# EAGLE design J3_output (EAGLE 7.7.0)
Redwave S310-J6 Output to 10 Pin MiniFit Valve Driver Board
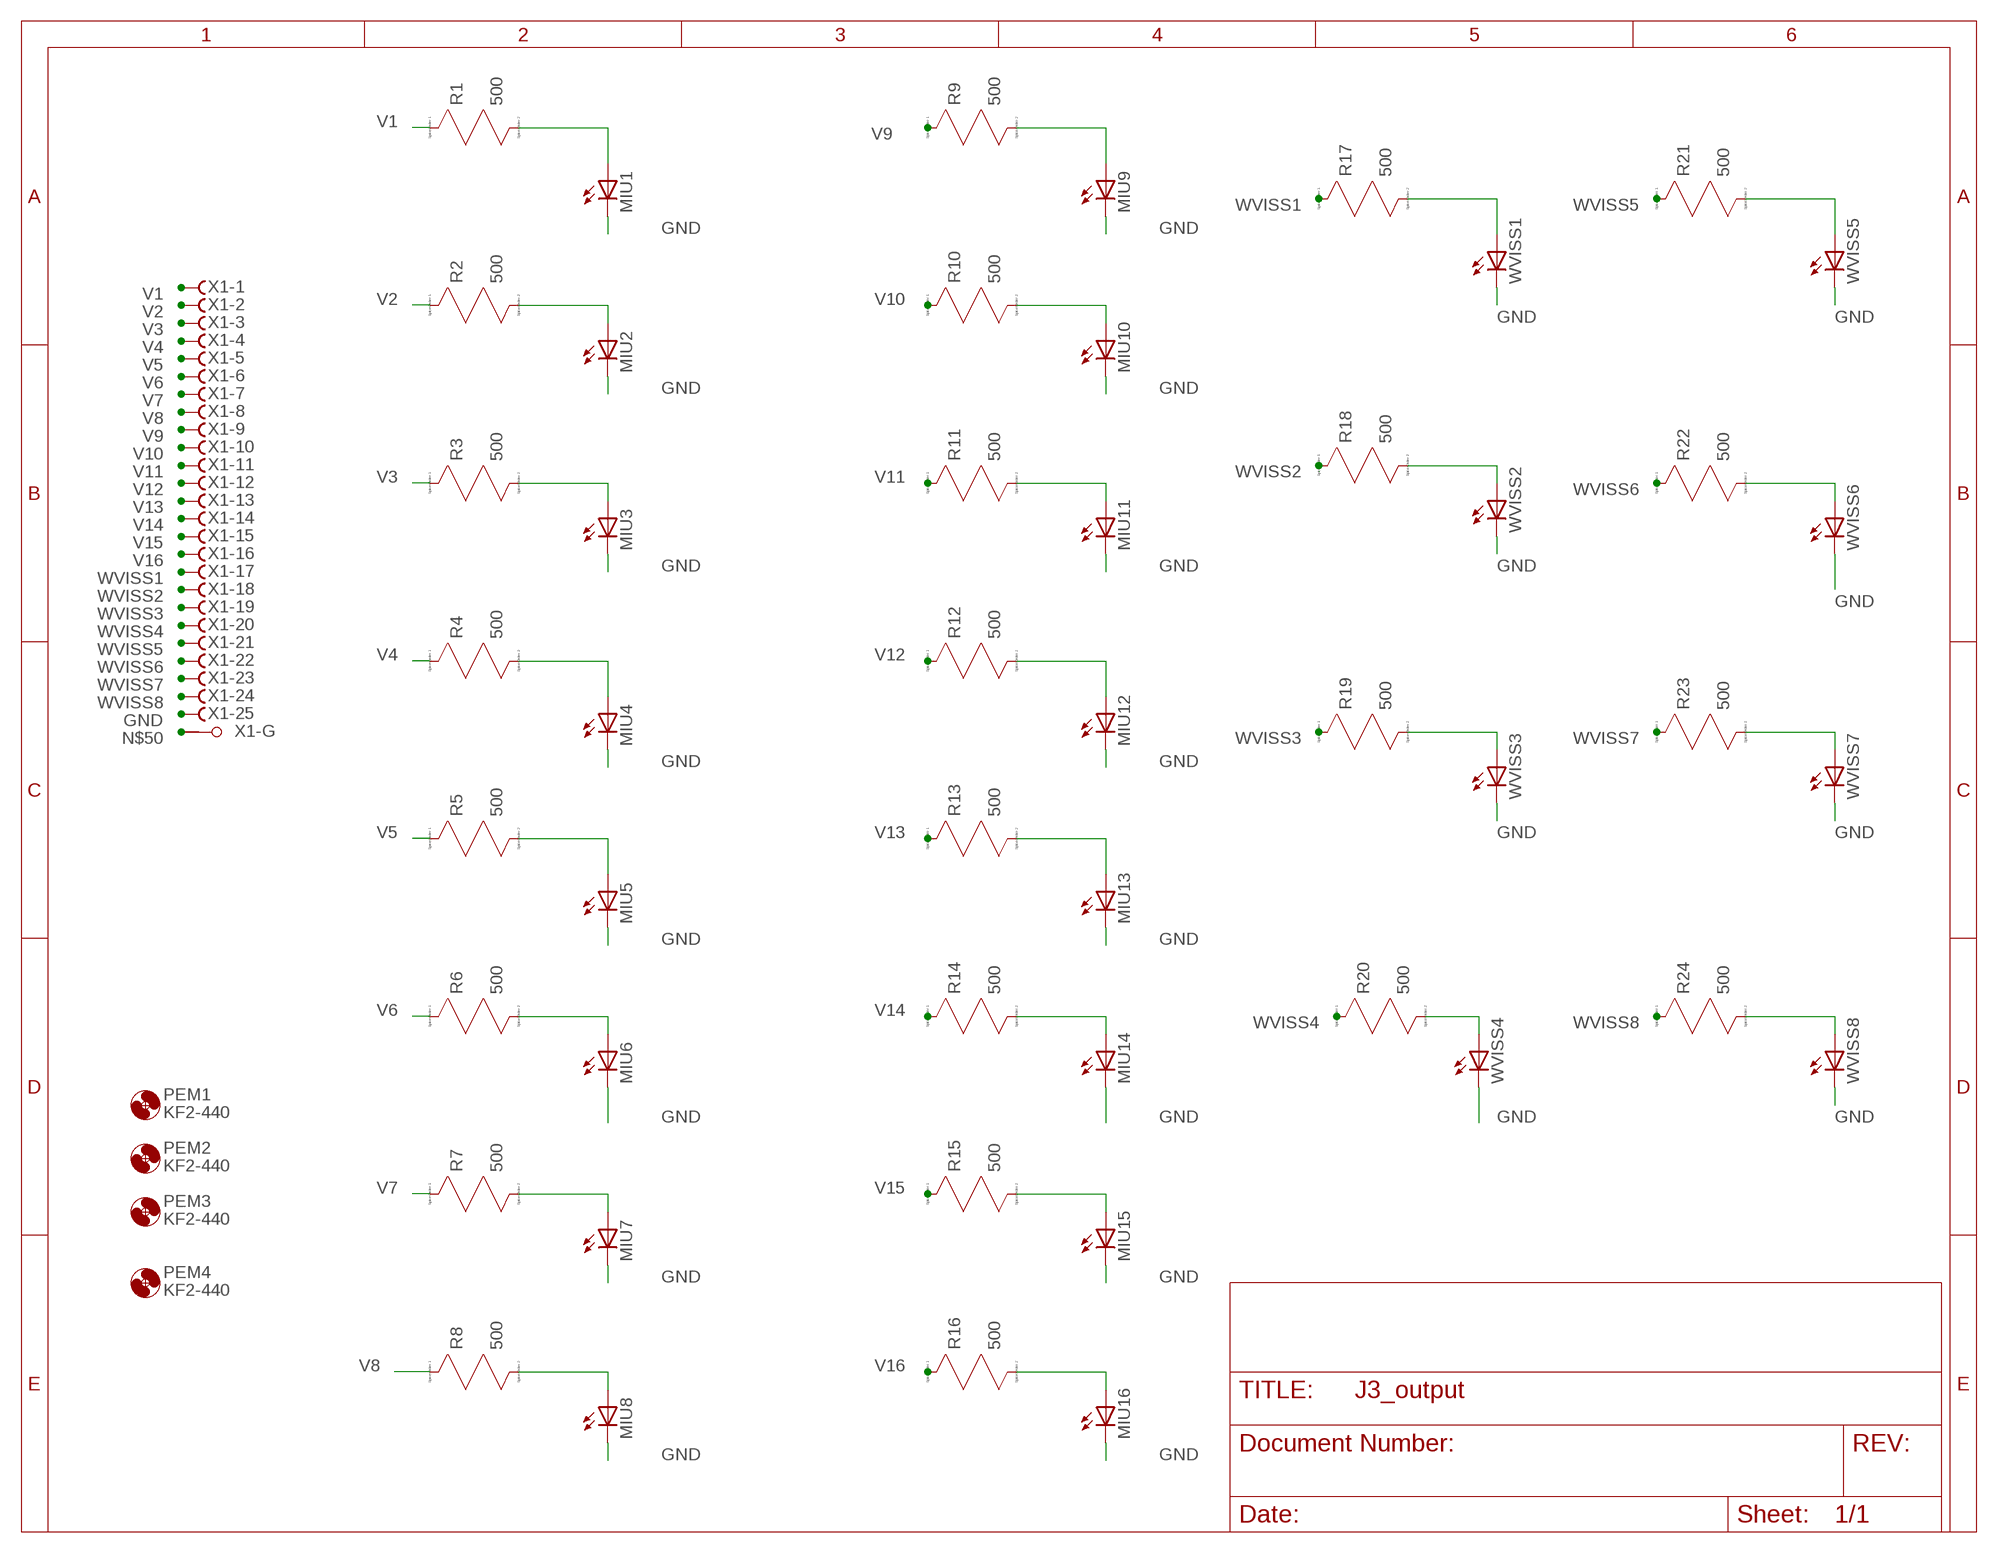
[diagram p0: schematic, sheet 1]

## Parts
MIU1  LED5MM  [LED5MM]
MIU2  LED5MM  [LED5MM]
MIU3  LED5MM  [LED5MM]
MIU4  LED5MM  [LED5MM]
MIU5  LED5MM  [LED5MM]
MIU6  LED5MM  [LED5MM]
MIU7  LED5MM  [LED5MM]
MIU8  LED5MM  [LED5MM]
MIU9  LED5MM  [LED5MM]
MIU10  LED5MM  [LED5MM]
MIU11  LED5MM  [LED5MM]
MIU12  LED5MM  [LED5MM]
MIU13  LED5MM  [LED5MM]
MIU14  LED5MM  [LED5MM]
MIU15  LED5MM  [LED5MM]
MIU16  LED5MM  [LED5MM]
PEM1  KF2-440  [KF2-440]
PEM2  KF2-440  [KF2-440]
PEM3  KF2-440  [KF2-440]
PEM4  KF2-440  [KF2-440]
R1  500  RES  [R0805]
R2  500  RES  [R0805]
R3  500  RES  [R0805]
R4  500  RES  [R0805]
R5  500  RES  [R0805]
R6  500  RES  [R0805]
R7  500  RES  [R0805]
R8  500  RES  [R0805]
R9  500  RES  [R0805]
R10  500  RES  [R0805]
R11  500  RES  [R0805]
R12  500  RES  [R0805]
R13  500  RES  [R0805]
R14  500  RES  [R0805]
R15  500  RES  [R0805]
R16  500  RES  [R0805]
R17  500  RES  [R0805]
R18  500  RES  [R0805]
R19  500  RES  [R0805]
R20  500  RES  [R0805]
R21  500  RES  [R0805]
R22  500  RES  [R0805]
R23  500  RES  [R0805]
R24  500  RES  [R0805]
WVISS1  LED5MM  [LED5MM]
WVISS2  LED5MM  [LED5MM]
WVISS3  LED5MM  [LED5MM]
WVISS4  LED5MM  [LED5MM]
WVISS5  LED5MM  [LED5MM]
WVISS6  LED5MM  [LED5MM]
WVISS7  LED5MM  [LED5MM]
WVISS8  LED5MM  [LED5MM]
X1  F25HPS  [F25HP]

## Nets
GND: MIU1.K(C) MIU2.K(C) MIU3.K(C) MIU4.K(C) MIU5.K(C) MIU6.K(C) MIU7.K(C) MIU8.K(C) MIU9.K(C) MIU10.K(C) MIU11.K(C) MIU12.K(C) MIU13.K(C) MIU14.K(C) MIU15.K(C) MIU16.K(C) WVISS1.K(C) WVISS2.K(C) WVISS3.K(C) WVISS4.K(C) WVISS5.K(C) WVISS6.K(C) WVISS7.K(C) WVISS8.K(C) X1.25(-25:F)
N$1: MIU1.A R1.2(B)
N$2: MIU2.A R2.2(B)
N$3: MIU3.A R3.2(B)
N$4: MIU4.A R4.2(B)
N$5: MIU5.A R5.2(B)
N$6: MIU6.A R6.2(B)
N$7: MIU7.A R7.2(B)
N$8: MIU8.A R8.2(B)
N$9: MIU9.A R9.2(B)
N$10: MIU10.A R10.2(B)
N$11: MIU11.A R11.2(B)
N$12: MIU12.A R12.2(B)
N$13: MIU13.A R13.2(B)
N$14: MIU14.A R14.2(B)
N$15: MIU15.A R15.2(B)
N$16: MIU16.A R16.2(B)
N$17: R17.2(B) WVISS1.A
N$18: R18.2(B) WVISS2.A
N$19: R19.2(B) WVISS3.A
N$20: R20.2(B) WVISS4.A
N$21: R21.2(B) WVISS5.A
N$22: R22.2(B) WVISS6.A
N$23: R23.2(B) WVISS7.A
N$24: R24.2(B) WVISS8.A
N$50: X1.G1(-G:G1)
V1: R1.1(A) X1.1(-1:F)
V2: R2.1(A) X1.2(-2:F)
V3: R3.1(A) X1.3(-3:F)
V4: R4.1(A) X1.4(-4:F)
V5: R5.1(A) X1.5(-5:F)
V6: R6.1(A) X1.6(-6:F)
V7: R7.1(A) X1.7(-7:F)
V8: R8.1(A) X1.8(-8:F)
V9: R9.1(A) X1.9(-9:F)
V10: R10.1(A) X1.10(-10:F)
V11: R11.1(A) X1.11(-11:F)
V12: R12.1(A) X1.12(-12:F)
V13: R13.1(A) X1.13(-13:F)
V14: R14.1(A) X1.14(-14:F)
V15: R15.1(A) X1.15(-15:F)
V16: R16.1(A) X1.16(-16:F)
WVISS1: R17.1(A) X1.17(-17:F)
WVISS2: R18.1(A) X1.18(-18:F)
WVISS3: R19.1(A) X1.19(-19:F)
WVISS4: R20.1(A) X1.20(-20:F)
WVISS5: R21.1(A) X1.21(-21:F)
WVISS6: R22.1(A) X1.22(-22:F)
WVISS7: R23.1(A) X1.23(-23:F)
WVISS8: R24.1(A) X1.24(-24:F)
Unconnected: X1.G2(-G:G2)

## Library data of the parts
MIU1-MIU16 WVISS1-WVISS8 = led:LED: LED OSRAM: - CHIPLED LG R971, LG N971, LY N971, LG Q971, LY Q971, LO R971, LY R971 LH N974, LH R974 LS Q976, LO Q976, LY Q976 LO Q996 - Hyper CHIPLED LW Q18S LB Q993, LB Q99A, LB R99A - SideLED LS A670, LO A670, LY A670, LG A670, LP A670 LB A673, LV A673, LT A673, LW A673 LH A674 LY A675 LS A676, LA A676, LO A676, LY A676, LW A676 LS A679, LY A679, LG A679 - Hyper Micro SIDELED® LS Y876, LA Y876, LO Y876, LY Y876 LT Y87S - SmartLED LW L88C, LW L88S LB L89C, LB L89S, LG L890 LS L89K, LO L89K, LY L89K LS L896, LA L896, LO L896, LY L896 - TOPLED LS T670, LO T670, LY T670, LG T670, LP T670 LSG T670, LSP T670, LSY T670, LOP T670, LYG T670 LG T671, LOG T671, LSG T671 LB T673, LV T673, LT T673, LW T673 LH T674 LS T676, LA T676, LO T676, LY T676, LB T676, LH T676, LSB T676, LW T676 LB T67C, LV T67C, LT T67C, LS T67K, LO T67K, LY T67K, LW E67C LS E67B, LA E67B, LO E67B, LY E67B, LB E67C, LV E67C, LT E67C LW T67C LS T679, LY T679, LG T679 LS T770, LO T770, LY T770, LG T770, LP T770 LB T773, LV T773, LT T773, LW T773 LH T774 LS E675, LA E675, LY E675, LS T675 LS T776, LA T776, LO T776, LY T776, LB T776 LHGB T686 LT T68C, LB T68C - Hyper Mini TOPLED® LB M676 - Mini TOPLED Santana® LG M470 LS M47K, LO M47K, LY M47K Source: http://www.osram.convergy.de LUXEON: - LUMILED® LXK2-PW12-R00, LXK2-PW12-S00, LXK2-PW14-U00, LXK2-PW14-V00 LXK2-PM12-R00, LXK2-PM12-S00, LXK2-PM14-U00 LXK2-PE12-Q00, LXK2-PE12-R00, LXK2-PE12-S00, LXK2-PE14-T00, LXK2-PE14-U00 LXK2-PB12-K00, LXK2-PB12-L00, LXK2-PB12-M00, LXK2-PB14-N00, LXK2-PB14-P00, LXK2-PB14-Q00 LXK2-PR12-L00, LXK2-PR12-M00, LXK2-PR14-Q00, LXK2-PR14-R00 LXK2-PD12-Q00, LXK2-PD12-R00, LXK2-PD12-S00 LXK2-PH12-R00, LXK2-PH12-S00 LXK2-PL12-P00, LXK2-PL12-Q00, LXK2-PL12-R00 Source: www.luxeon.com KINGBRIGHT: KA-3528ASYC Source: www.kingbright.com; OC_NEWARK: unknown
PEM1-PEM4 = penn-engineering:KF2-: TYPE KF2 AND KFS2 BROACHING NUTS
R1-R24 = sym:RES: A resistor; MF: BC COMPONENTS; MPN: SFR2500001401FR500; OC_NEWARK: 94C4790
X1 = con-subd:F25HPS: SUB-D; OC_FARNELL: unknown; OC_NEWARK: unknown

## Board
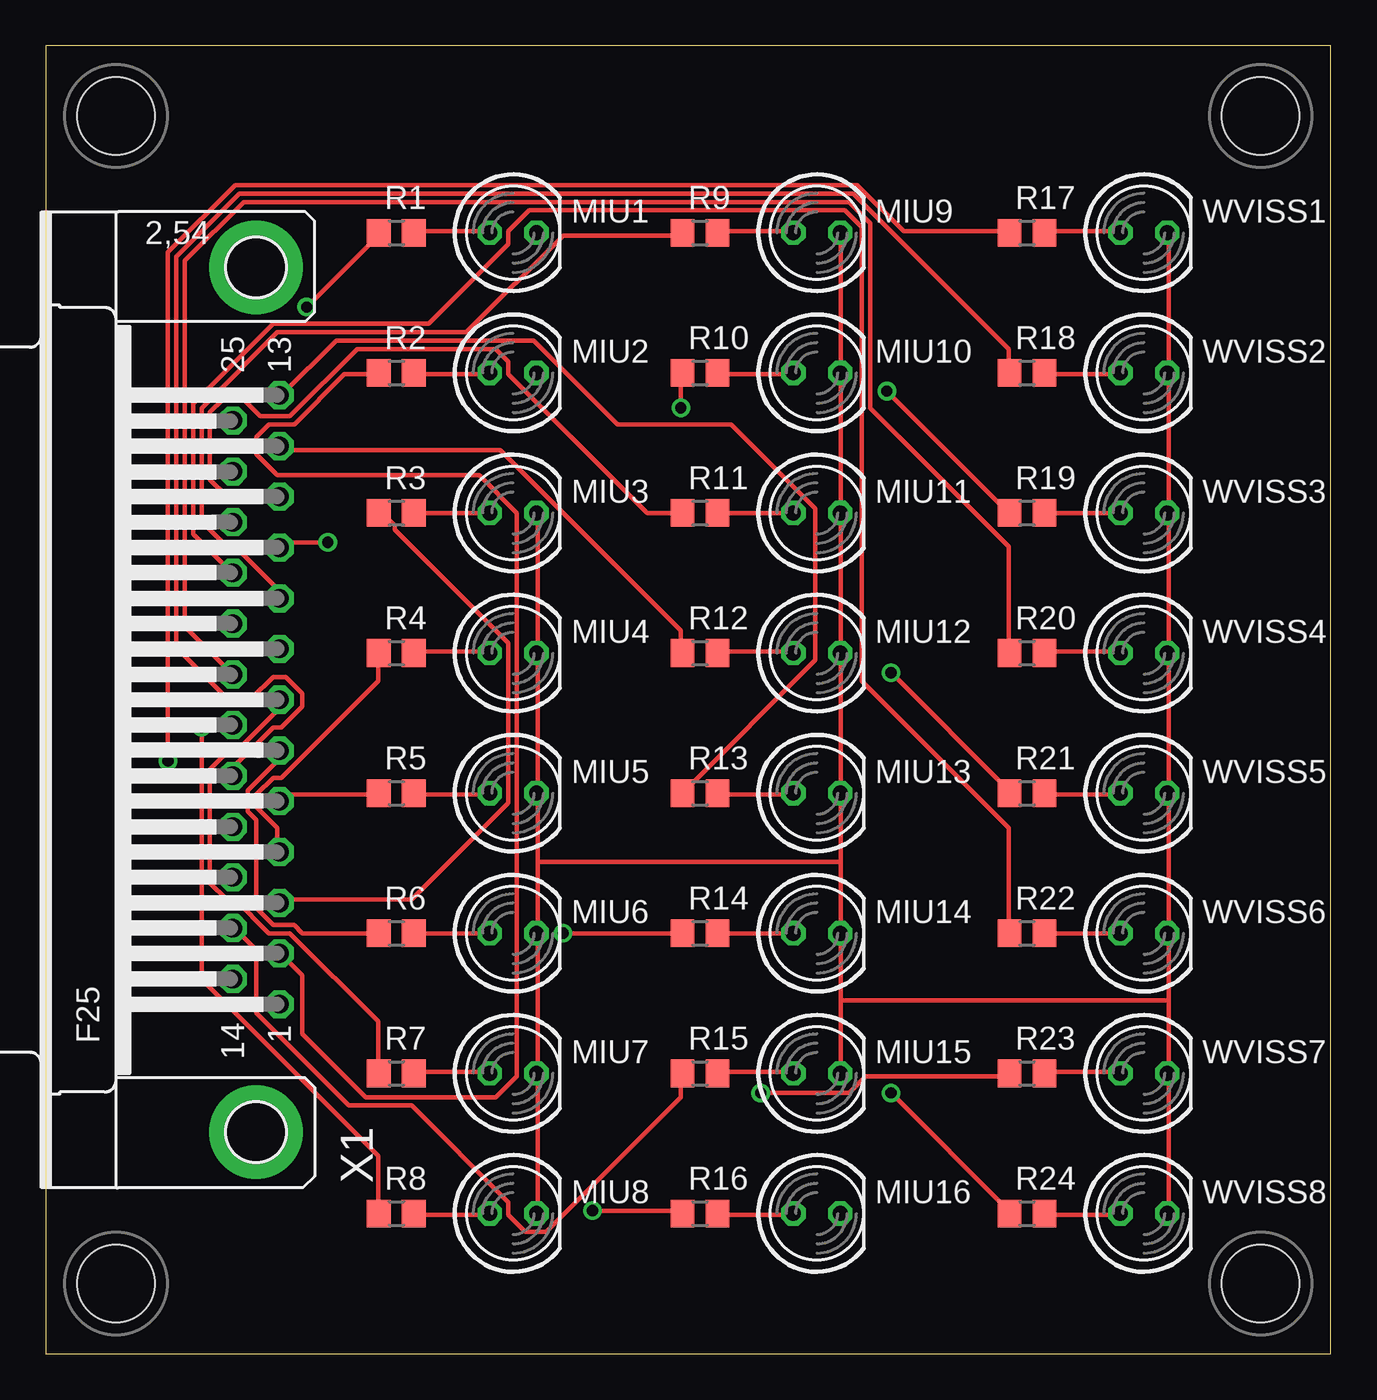
[diagram p1: board, top side]
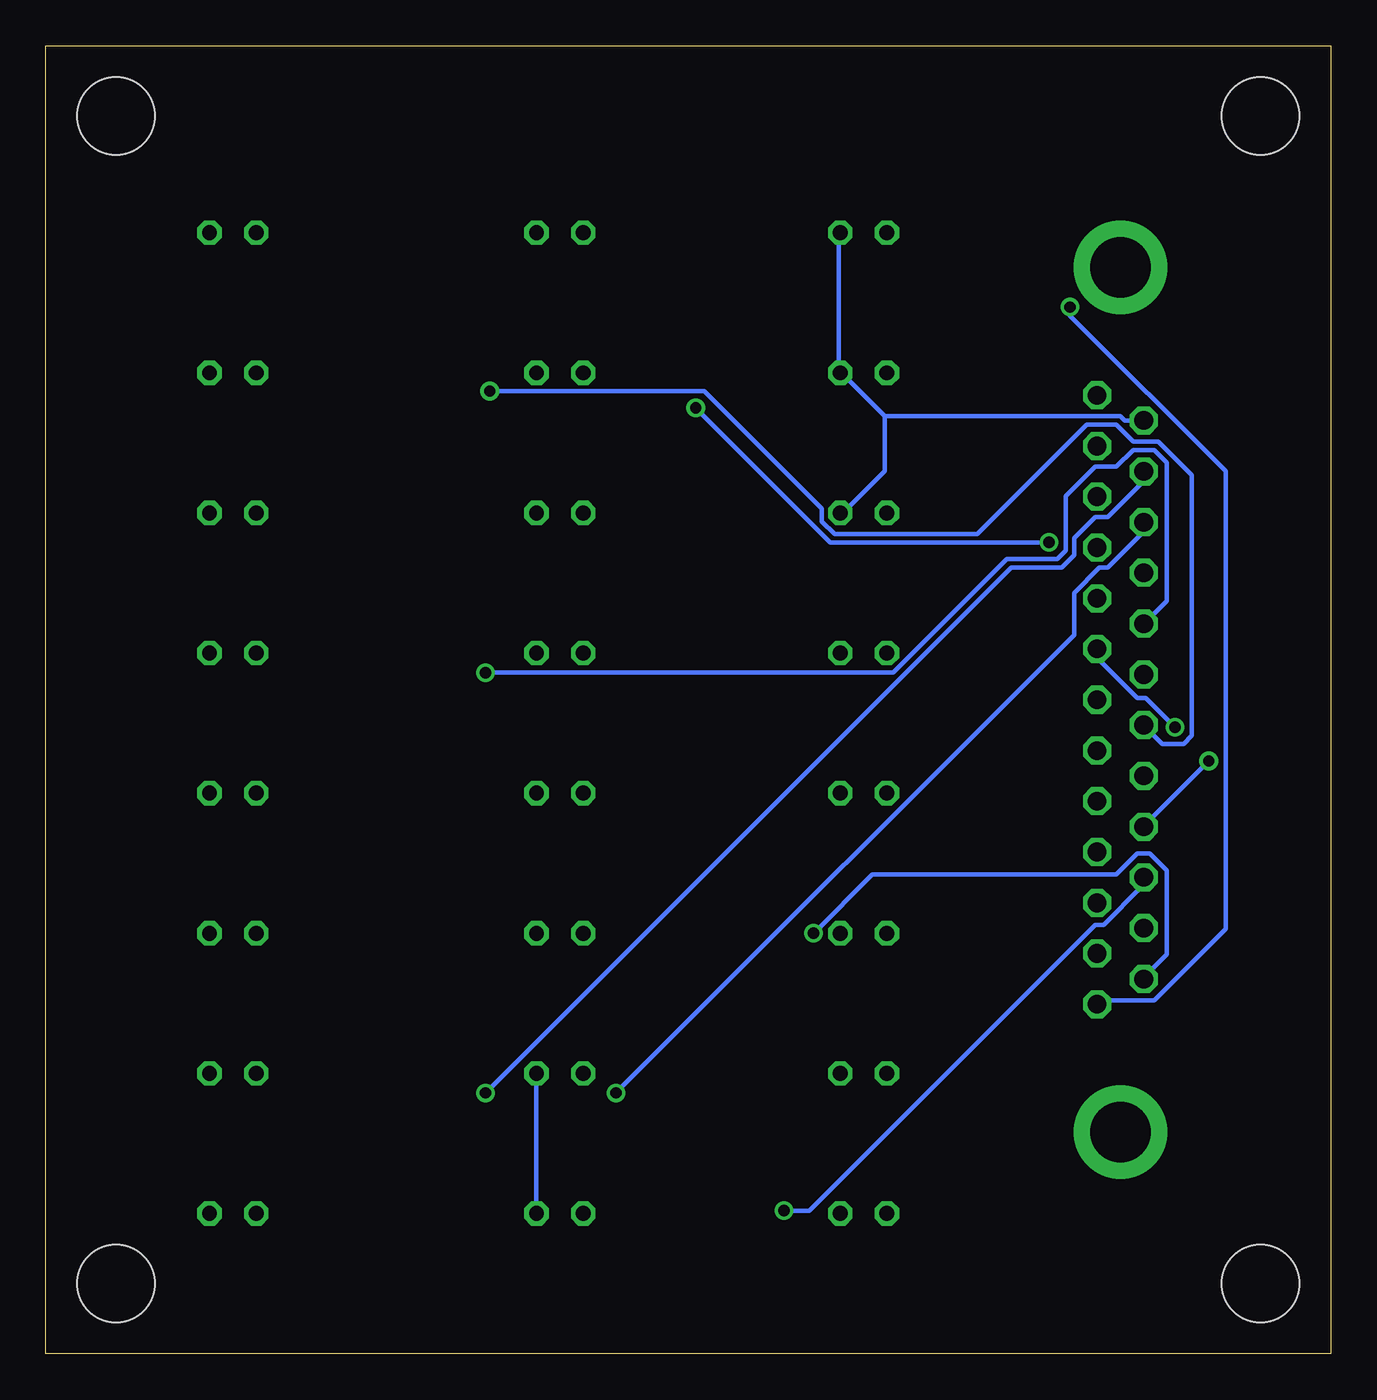
[diagram p2: board, bottom side, seen from below]

Size 69.85 x 71.12 mm. Coordinates in mm from the lower left corner, seen from the top.
Outline: 0,0 69.85,0 69.85,71.12 0,71.12 0,0
Copper layers (1*16): Top 0.035mm / dielectric 1.5mm / Bottom 0.035mm
Design rules "default": minimum track width 10mil, minimum drill 24mil, track to track 8mil, track to pad 8mil, pad to pad 8mil, via to via 8mil, smd to smd 8mil, copper to edge 40mil, drill to drill 8mil, minimum pad ring 10mil, minimum via ring 8mil, stop-mask expansion 4mil, vias tented up to drill 0mil, thermal gap 10mil

### Footprints (pad centres in the part's own frame; a part is rotated, then mirrored left to right if it is on the bottom)
LED5MM = drill 0.813 octagon: A -1.27,0; K 1.27,0
KF2-440 = hole 4.216: 0,0
R0805 = smd 1.3 x 1.5: 1 -0.95,0; 2 0.95,0
F25HP = drill 1.016 octagon: 1 -16.561,-1.27; 2 -13.792,-1.27; 3 -11.049,-1.27; 4 -8.28,-1.27; 5 -5.512,-1.27; 6 -2.769,-1.27; 7 0,-1.27; 8 2.769,-1.27; 9 5.512,-1.27; 10 8.28,-1.27; 11 11.049,-1.27; 12 13.792,-1.27; 13 16.561,-1.27; 14 -15.189,1.27; 15 -12.421,1.27; 16 -9.652,1.27; 17 -6.909,1.27; 18 -4.14,1.27; 19 -1.372,1.27; 20 1.372,1.27; 21 4.14,1.27; 22 6.909,1.27; 23 9.652,1.27; 24 12.421,1.27; 25 15.189,1.27 | drill 3.302 pad 5.08: G1 -23.52,0; G2 23.52,0

### Placement (x,y rotation side)
MIU1  25.4,60.96 0 top
MIU2  25.4,53.34 0 top
MIU3  25.4,45.72 0 top
MIU4  25.4,38.1 0 top
MIU5  25.4,30.48 0 top
MIU6  25.4,22.86 0 top
MIU7  25.4,15.24 0 top
MIU8  25.4,7.62 0 top
MIU9  41.91,60.96 0 top
MIU10  41.91,53.34 0 top
MIU11  41.91,45.72 0 top
MIU12  41.91,38.1 0 top
MIU13  41.91,30.48 0 top
MIU14  41.91,22.86 0 top
MIU15  41.91,15.24 0 top
MIU16  41.91,7.62 0 top
PEM1  3.81,3.81 0 top
PEM2  3.81,67.31 0 top
PEM3  66.04,3.81 0 top
PEM4  66.04,67.31 0 top
R1  19.05,60.96 0 top
R2  19.05,53.34 0 top
R3  19.05,45.72 0 top
R4  19.05,38.1 0 top
R5  19.05,30.48 0 top
R6  19.05,22.86 0 top
R7  19.05,15.24 0 top
R8  19.05,7.62 0 top
R9  35.56,60.96 0 top
R10  35.56,53.34 0 top
R11  35.56,45.72 0 top
R12  35.56,38.1 0 top
R13  35.56,30.48 0 top
R14  35.56,22.86 0 top
R15  35.56,15.24 0 top
R16  35.56,7.62 0 top
R17  53.34,60.96 0 top
R18  53.34,53.34 0 top
R19  53.34,45.72 0 top
R20  53.34,38.1 0 top
R21  53.34,30.48 0 top
R22  53.34,22.86 0 top
R23  53.34,15.24 0 top
R24  53.34,7.62 0 top
WVISS1  59.69,60.96 0 top
WVISS2  59.69,53.34 0 top
WVISS3  59.69,45.72 0 top
WVISS4  59.69,38.1 0 top
WVISS5  59.69,30.48 0 top
WVISS6  59.69,22.86 0 top
WVISS7  59.69,15.24 0 top
WVISS8  59.69,7.62 0 top
X1  11.43,35.56 90 top

### Tracks (layer width: path | path; a pad name or v marks a point on that pad's centre or on a via)
GND
  Top 0.254: 61.04,45.72 61.04,53.26 WVISS2.K 61.04,53.49 61.04,60.81 WVISS1.K | WVISS8.K 61.04,7.77 61.04,15.09 WVISS7.K 61.04,15.32 61.04,19.2 | 61.04,22.86 61.04,30.4 WVISS5.K 61.04,30.63 61.04,37.95 WVISS4.K 61.04,38.18 61.04,45.72 | 61.04,22.86 61.04,19.2 | 61.04,22.86 WVISS6.K | 61.04,45.72 WVISS3.K | 43.2,45.72 43.2,53.26 MIU10.K 43.2,53.49 43.2,60.81 MIU9.K | 43.2,26.75 43.2,30.4 MIU13.K 43.2,30.63 43.2,37.95 MIU12.K 43.2,38.18 43.2,45.72 | 43.2,26.75 43.2,22.86 | 43.2,22.86 43.2,19.2 | 43.2,19.2 43.2,15.32 MIU15.K | 43.2,22.86 MIU14.K | 43.2,45.72 MIU11.K | MIU8.K 26.75,7.77 26.75,15.09 MIU7.K 26.75,15.32 26.75,22.86 | 26.75,26.75 26.75,30.4 MIU5.K 26.75,30.63 26.75,37.95 MIU4.K 26.75,38.18 26.75,45.72 MIU3.K | 26.75,26.75 26.75,22.86 | 26.75,22.86 MIU6.K | 26.75,26.75 43.2,26.75 | 43.2,19.2 61.04,19.2
  Bottom 0.254: MIU16.K 43.2,7.77 43.2,15.09 MIU15.K | MIU1.K 26.75,60.81 26.75,53.49 MIU2.K 26.52,53.26 24.23,50.98 | X1.25 11.2,50.75 11.43,50.98 24.23,50.98 | 24.23,50.98 24.23,48.01 26.52,45.72 MIU3.K
N$1
  Top 0.254: R1.2 20.12,61.04 24,61.04 MIU1.A
N$2
  Top 0.254: R2.2 20.12,53.26 24,53.26 MIU2.A
N$3
  Top 0.254: MIU3.A R3.2
N$4
  Top 0.254: R4.2 20.12,38.18 24,38.18 MIU4.A
N$5
  Top 0.254: R5.2 20.12,30.4 24,30.4 MIU5.A
N$6
  Top 0.254: MIU6.A R6.2
N$7
  Top 0.254: R7.2 20.12,15.32 24,15.32 MIU7.A
N$8
  Top 0.254: R8.2 20.12,7.54 24,7.54 MIU8.A
N$9
  Top 0.254: R9.2 36.58,61.04 40.46,61.04 MIU9.A
N$10
  Top 0.254: R10.2 36.58,53.26 40.46,53.26 MIU10.A
N$11
  Top 0.254: MIU11.A R11.2
N$12
  Top 0.254: R12.2 36.58,38.18 40.46,38.18 MIU12.A
N$13
  Top 0.254: R13.2 36.58,30.4 40.46,30.4 MIU13.A
N$14
  Top 0.254: MIU14.A R14.2
N$15
  Top 0.254: R15.2 36.58,15.32 40.46,15.32 MIU15.A
N$16
  Top 0.254: R16.2 36.58,7.54 40.46,7.54 MIU16.A
N$17
  Top 0.254: R17.2 54.41,61.04 58.29,61.04 WVISS1.A
N$18
  Top 0.254: R18.2 54.41,53.26 58.29,53.26 WVISS2.A
N$19
  Top 0.254: WVISS3.A R19.2
N$20
  Top 0.254: R20.2 54.41,38.18 58.29,38.18 WVISS4.A
N$21
  Top 0.254: R21.2 54.41,30.4 58.29,30.4 WVISS5.A
N$22
  Top 0.254: WVISS6.A R22.2
N$23
  Top 0.254: R23.2 54.41,15.32 58.29,15.32 WVISS7.A
N$24
  Top 0.254: R24.2 54.41,7.54 58.29,7.54 WVISS8.A
V1  (via drill 0.61)
  Top 0.254: v14.17,56.92 18.06,60.81 R1.1
  Bottom 0.254: v14.17,56.92 14.17,56.46 5.71,48.01 5.71,23.09 9.6,19.2 12.57,19.2 X1.1
V2
  Top 0.254: R2.1 18.06,53.26 16.23,53.26 13.49,50.52 12.12,50.52 11.43,49.84 11.43,48.92 12.57,47.78 23.55,47.78 25.6,45.72 25.6,15.09 24.46,13.95 17.37,13.95 13.95,17.37 13.95,20.57 12.8,21.72 X1.2
V3
  Top 0.254: R3.1 18.29,45.72 18.97,45.03 18.97,44.81 25.15,38.63 25.15,29.95 19.89,24.69 12.8,24.69 X1.3
V4
  Top 0.254: R4.1 18.06,37.95 18.06,36.58 12.8,31.32 12.34,31.32 11.43,30.4 11.43,29.72 12.57,28.57 12.57,27.43 X1.4
V5
  Top 0.254: R5.1 18.06,30.4 13.03,30.4 12.8,30.18 X1.5
V6
  Top 0.254: R6.1 13.95,22.86 13.49,23.32 12.34,23.32 11.43,24.23 11.43,29.03 10.97,29.49 10.97,30.63 12.57,32.23 12.57,32.69 X1.6
V7
  Top 0.254: R7.1 18.06,15.32 18.06,18.06 13.26,22.86 12.12,22.86 10.29,24.69 9.83,24.69 8.91,25.6 8.91,31.77 10.06,32.92 10.52,32.92 12.57,34.98 12.57,35.43 X1.7
V8  (via drill 0.61)
  Top 0.254: v8.46,34.06 8.46,20.34 18.06,10.74 18.06,7.77 R8.1
  Bottom 0.254: v8.46,34.06 10.06,35.66 10.52,35.66 12.57,37.72 12.57,38.18 X1.8
V9
  Top 0.254: R9.1 34.52,60.81 28.12,60.81 22.86,55.55 12.57,55.55 8.46,51.44 8.46,45.26 10.06,43.66 10.52,43.66 12.57,41.6 12.57,41.15 X1.9
V10  (via drill 0.61)
  Top 0.254: v34.52,51.44 34.52,53.26 R10.1 | v15.32,44.12 13.03,44.12 12.8,43.89 X1.10
  Bottom 0.254: v34.52,51.44 27.2,44.12 v15.32,44.12
V11
  Top 0.254: R11.1 32.69,45.72 25.15,53.26 25.15,53.95 24.46,54.63 16.92,54.63 13.26,50.98 11.66,50.98 10.74,51.89 9.6,51.89 8.91,51.21 8.91,47.55 9.83,46.63 12.57,46.63 X1.11
V12
  Top 0.254: R12.1 34.52,38.18 34.52,39.32 24.69,49.15 12.8,49.15 X1.12
V13
  Top 0.254: R13.1 34.75,30.63 41.83,37.72 41.83,45.95 37.26,50.52 31.09,50.52 26.52,55.09 15.77,55.09 12.8,52.12 X1.13
V14  (via drill 0.61)
  Top 0.254: v28.12,22.86 R14.1
  Bottom 0.254: v28.12,22.86 24.92,26.06 11.66,26.06 10.52,27.2 9.83,27.2 8.91,26.29 8.91,21.72 10.06,20.57 X1.14
V15
  Top 0.254: R15.1 34.52,15.09 34.52,13.95 27.2,6.63 26.06,6.63 25.15,7.54 25.15,8.23 19.89,13.49 16.46,13.49 11.43,18.52 11.43,21.95 10.29,23.09 X1.15
V16  (via drill 0.61)
  Top 0.254: v29.72,7.77 34.52,7.77 R16.1
  Bottom 0.254: v29.72,7.77 28.35,7.77 12.8,23.32 12.34,23.32 10.29,25.38 10.29,25.83 X1.16
WVISS1  (via drill 0.61)
  Top 0.254: v6.63,32.23 6.63,59.89 10.29,63.55 44.12,63.55 46.63,61.04 52.35,61.04 R17.1
  Bottom 0.254: v6.63,32.23 10.06,28.8 X1.17
WVISS2
  Top 0.254: R18.1 52.35,53.49 52.35,54.63 43.89,63.09 10.52,63.09 7.09,59.66 7.09,38.41 9.83,35.66 11.2,35.66 12.34,36.8 13.03,36.8 13.95,35.89 13.95,35.2 12.8,34.06 12.34,34.06 10.29,32 10.29,31.55 X1.18
WVISS3  (via drill 0.61)
  Top 0.254: v45.72,52.35 52.35,45.72 R19.1
  Bottom 0.254: v45.72,52.35 34.06,52.35 27.66,45.95 27.66,45.26 26.98,44.58 19.2,44.58 13.26,50.52 11.66,50.52 10.74,49.61 9.37,49.61 7.54,47.78 7.54,33.6 8,33.15 9.14,33.15 10.06,34.06 X1.19
WVISS4
  Top 0.254: X1.20 7.54,39.55 7.54,59.44 10.74,62.64 43.66,62.64 44.81,61.49 44.81,51.44 52.35,43.89 52.35,38.18 R20.1
WVISS5  (via drill 0.61)
  Top 0.254: v45.95,37.03 52.35,30.63 R21.1
  Bottom 0.254: v45.95,37.03 23.77,37.03 17.6,43.2 14.86,43.2 14.4,43.66 14.4,46.63 12.8,48.23 11.66,48.23 10.74,49.15 9.6,49.15 8.91,48.46 8.91,40.92 10.06,39.78 X1.21
WVISS6
  Top 0.254: R22.1 52.35,22.86 52.35,28.57 44.35,36.58 44.35,61.27 43.43,62.18 26.29,62.18 25.15,61.04 25.15,60.35 20.8,56.01 12.34,56.01 8,51.66 8,44.58 10.06,42.52 X1.22
WVISS7  (via drill 0.61)
  Top 0.254: v38.86,14.17 43.66,14.17 44.58,15.09 52.35,15.09 R23.1
  Bottom 0.254: v38.86,14.17 13.95,39.09 13.95,41.38 12.57,42.75 12.12,42.75 10.29,44.58 10.29,45.03 X1.23
WVISS8  (via drill 0.61)
  Top 0.254: v45.95,14.17 52.35,7.77 R24.1
  Bottom 0.254: v45.95,14.17 17.37,42.75 14.63,42.75 13.95,43.43 13.95,44.35 12.8,45.49 12.12,45.49 10.29,47.32 10.29,47.78 X1.24